# EAGLE design power (EAGLE 9.6.2)
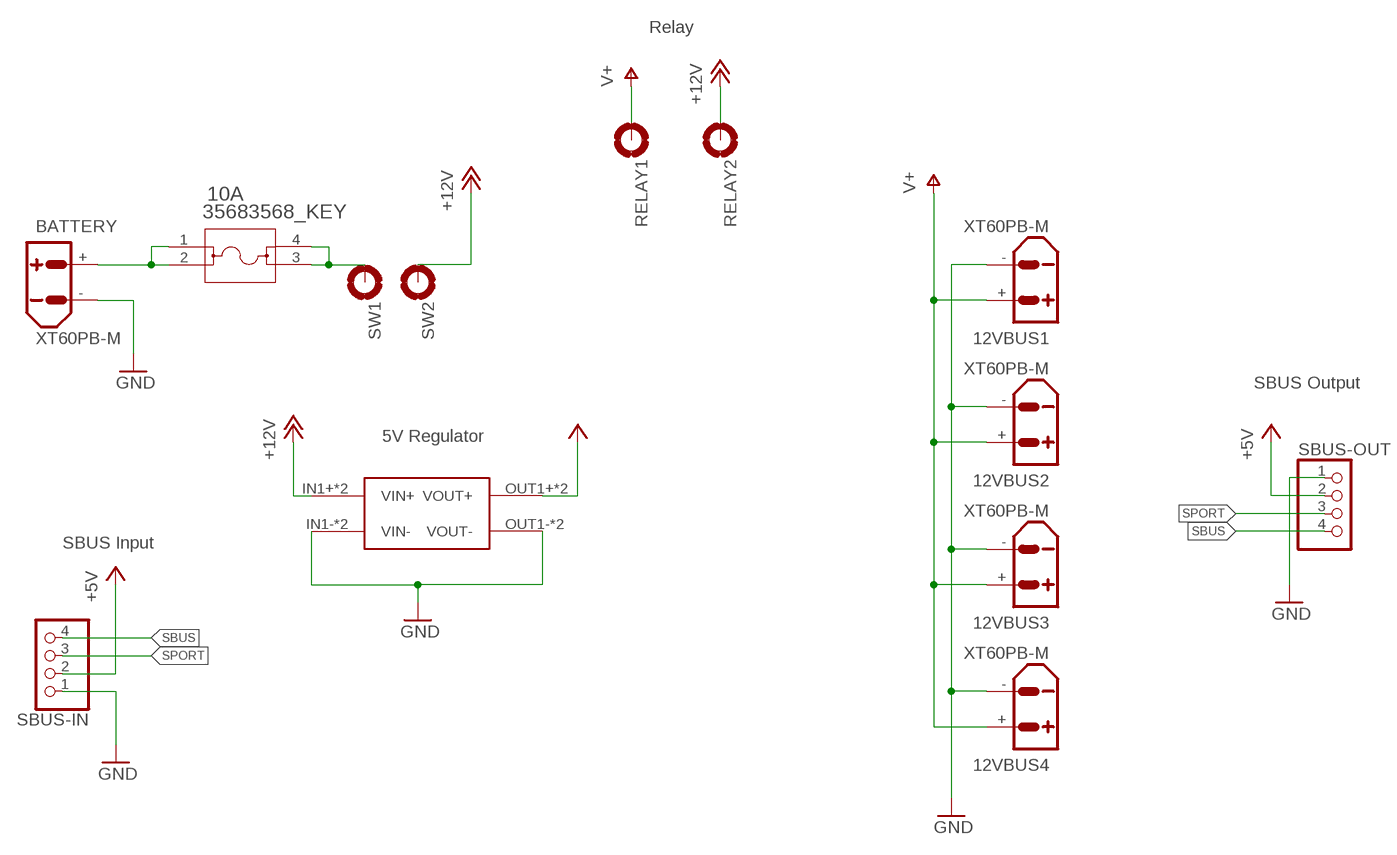
[diagram p0: schematic, sheet 1]

## Parts
10A  35683568_KEY  [3568_KEY]
12VBUS1  XT60PB-M  [XT60PB-M]
12VBUS2  XT60PB-M  [XT60PB-M]
12VBUS3  XT60PB-M  [XT60PB-M]
12VBUS4  XT60PB-M  [XT60PB-M]
BATTERY  XT60PB-M  [XT60PB-M]
RELAY1  MOUNT-PAD-ROUND2.8  [2,8-PAD]
RELAY2  MOUNT-PAD-ROUND2.8  [2,8-PAD]
SBUS-IN  PINHD-1X4  [1X04]
SBUS-OUT  PINHD-1X4  [1X04]
SW1  MOUNT-PAD-ROUND2.8  [2,8-PAD]
SW2  MOUNT-PAD-ROUND2.8  [2,8-PAD]
U$2  MP1584  [DC-BRICK]

## Nets
+5V: SBUS-IN.2 SBUS-OUT.2 U$2.OUT1+(VOUT+) U$2.OUT2+(VOUT+)
+12V: RELAY2.B2,8(MOUNT) SW2.B2,8(MOUNT) U$2.IN1+(VIN+) U$2.IN2+(VIN+)
GND: 12VBUS1.- 12VBUS2.- 12VBUS3.- 12VBUS4.- BATTERY.- SBUS-IN.1 SBUS-OUT.1 U$2.IN1-(VIN-) U$2.IN2-(VIN-) U$2.OUT1-(VOUT-) U$2.OUT2-(VOUT-)
N$1: 10A.1 10A.2 BATTERY.+
N$2: 10A.3 10A.4 SW1.B2,8(MOUNT)
SBUS: SBUS-IN.4 SBUS-OUT.4
SPORT: SBUS-IN.3 SBUS-OUT.3
V+: 12VBUS1.+ 12VBUS2.+ 12VBUS3.+ 12VBUS4.+ RELAY1.B2,8(MOUNT)

## Notes on the sheet
- Relay
- SBUS Output
- 5V Regulator
- SBUS Input

## Library data of the parts
10A = 2023-12-03_23-13-37_Library:3568; COPYRIGHT: Copyright (C) 2023 Ultra Librarian. All rights reserved.; MANUFACTURER_PART_NUMBER: 3568; MFR_NAME: Keystone Electronics
12VBUS1-12VBUS4 BATTERY = amass:XT60: AMASS XT60 connector Store in Japan AMASS XT60 connector <https://szc.jp/ams-xt60>
RELAY1 RELAY2 SW1 SW2 = holes:MOUNT-PAD-ROUND: MOUNTING PAD, round
SBUS-IN SBUS-OUT = pinhead:PINHD-1X4: PIN HEADER
U$2 = MP1584-dc-brick:MP1584: MP1584-dc-brick-pcb Step down Input: 4.5V - 28V Ouput 0.8V - 25V max. 3A Cheap on ebay

## Board
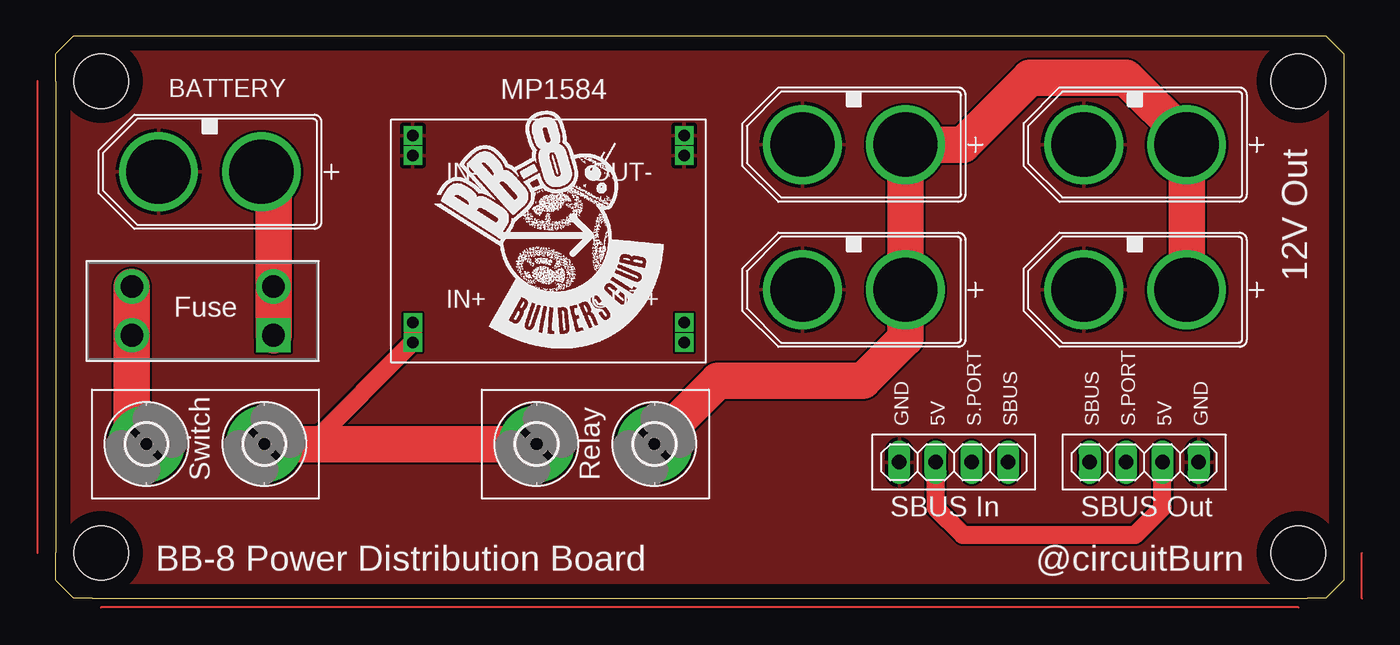
[diagram p1: board, top side]
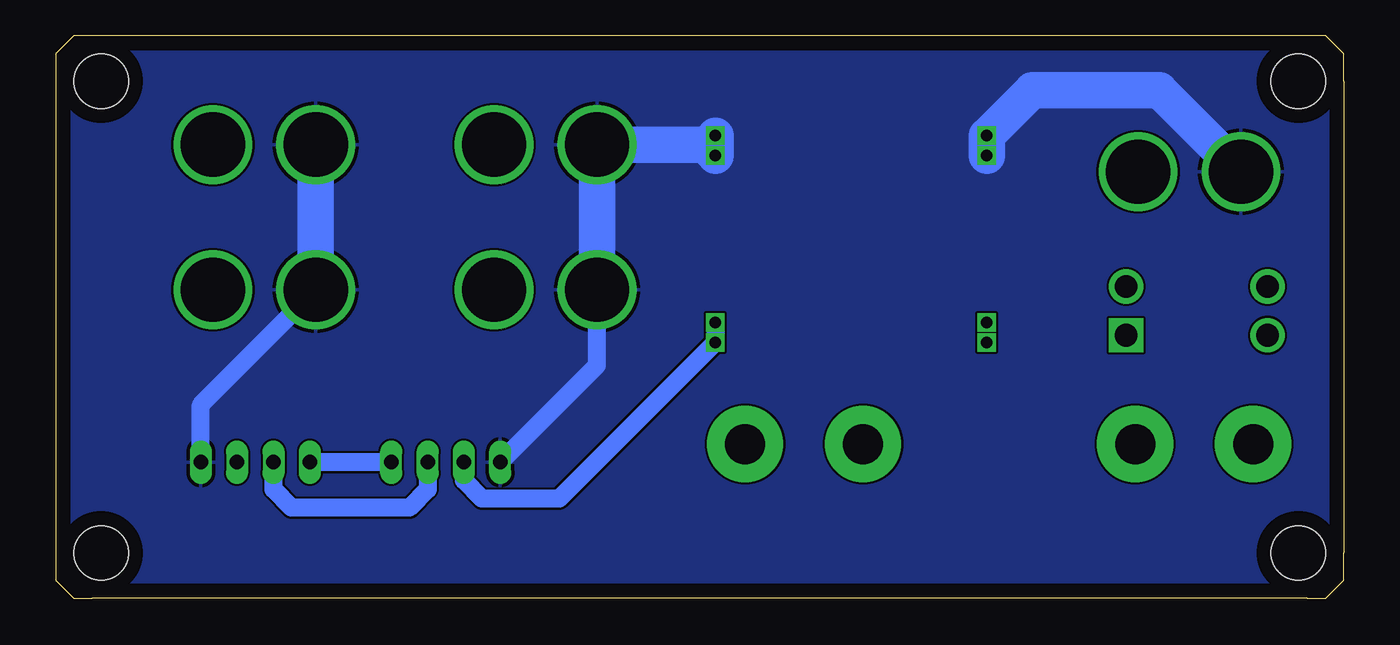
[diagram p2: board, bottom side, seen from below]

Size 90.17 x 39.37 mm. Coordinates in mm from the lower left corner, seen from the top.
Outline: 2.54,0 87.63,0 88.9,0 90.17,1.27 90.17,38.1 88.9,39.37 1.27,39.37 0,38.1 0,36.2 0,3.17 0,1.27 1.27,0 2.54,0
Copper layers (1*16): Top 0.035mm / dielectric 1.5mm / Bottom 0.035mm
Design rules "default": minimum track width 6mil, minimum drill 0.35mm, track to track 6mil, track to pad 6mil, pad to pad 6mil, via to via 6mil, smd to smd 6mil, copper to edge 40mil, drill to drill 6mil, minimum pad ring 10mil, minimum via ring 8mil, stop-mask expansion 4mil, vias tented up to drill 0mil, thermal gap 10mil
Holes 3.81 mm at 3.17,3.17 87,3.17 87,36.2 3.17,36.2

### Footprints (pad centres in the part's own frame; a part is rotated, then mirrored left to right if it is on the bottom)
3568_KEY = drill 1.6 pad 2.108 square: 1 0,0 | drill 1.6 pad 2.108: 2 0,-3.404; 3 9.906,-3.404; 4 9.906,0
XT60PB-M = drill 4.5: + 3.6,0; - -3.6,0
2,8-PAD = drill 2.8 pad 5.334: B2,8 0,0
1X04 = drill 1.016 long: 1 -3.81,0; 2 -1.27,0; 3 1.27,0; 4 3.81,0
DC-BRICK = drill 0.8 square: IN1+ 1.5,1.4; IN1- 1.5,14.47; IN2+ 1.5,2.8; IN2- 1.5,15.87; OUT1+ 20.5,1.4; OUT1- 20.5,14.47; OUT2+ 20.5,2.8; OUT2- 20.5,15.87

### Placement (x,y rotation side)
10A  15.24,18.42 180 top
12VBUS1  55.88,31.75 0 top
12VBUS2  55.88,21.59 0 top
12VBUS3  75.56,31.75 0 top
12VBUS4  75.56,21.59 0 top
BATTERY  10.79,29.85 0 top
RELAY1  41.91,10.79 0 top
RELAY2  33.66,10.79 0 top
SBUS-IN  62.87,9.53 0 top
SBUS-OUT  76.2,9.53 180 top
SW1  6.35,10.79 0 top
SW2  14.61,10.79 0 top
U$2  23.5,16.51 0 top

### Tracks (layer width: path | path; a pad name or v marks a point on that pad's centre or on a via)
+5V
  Top 1.27: SBUS-OUT.2 77.47,6.35 75.56,4.45 63.5,4.45 61.59,6.35 SBUS-IN.2
  Bottom 1.27: U$2.OUT2+ U$2.OUT1+ 54.92,6.98 60.33,6.98 61.59,8.26 SBUS-IN.2
+12V
  Top 1.27: U$2.IN2+ U$2.IN1+ 17.88,10.79
  Top 2.54: 32.11,10.79 RELAY2.B2,8 SW2.B2,8 17.88,10.79
GND
  Bottom 1.27: 12VBUS4.- 80.01,13.54 SBUS-OUT.1 | SBUS-IN.1 52.28,16.3 12VBUS2.-
  Bottom 2.54: BATTERY.- 12.91,35.56 21.82,35.56 U$2.IN2- U$2.IN1- | U$2.OUT2- U$2.OUT1- 44.77,31.75 12VBUS1.- 12VBUS2.- | 12VBUS3.- 12VBUS4.-
  pour Top: 0,1.27 0,38.1 1.27,39.37 88.9,39.37 90.17,38.1 90.17,1.27 88.9,0 1.27,0
  pour Bottom: 0,1.27 0,38.1 1.27,39.37 88.9,39.37 90.17,38.1 90.17,1.27 88.9,0 1.27,0
  pour Top: 0,1.27 0,38.1 1.27,39.37 88.9,39.37 90.17,38.1 90.17,1.27 88.9,0 1.27,0
  pour Bottom: 0,1.27 0,38.1 1.27,39.37 88.9,39.37 90.17,38.1 90.17,1.27 88.9,0 1.27,0
N$1
  Top 2.54: 10A.1 10A.2 15.24,29 BATTERY.+
N$2
  Top 2.54: SW1.B2,8 5.33,11.81 10A.4 10A.3
SBUS
  Bottom 1.27: SBUS-IN.4 SBUS-OUT.4
SPORT
  Bottom 1.27: SBUS-IN.3 64.14,7.62 65.41,6.35 73.66,6.35 74.93,7.62 SBUS-OUT.3
V+
  Top 2.54: 12VBUS4.+ 12VBUS3.+ 79.17,32.2 74.93,36.44 68.19,36.44 63.5,31.75 12VBUS1.+ 12VBUS2.+ 59.48,18.21 56.52,15.24 46.35,15.24 RELAY1.B2,8
(copper drawn outside any net)
  shapes: Top area x4

### Text on the board
tPlace: MP1584 | 12V Out | Fuse | GND | 5V | S.PORT | SBUS | SBUS | S.PORT | 5V | GND | Switch | Relay | SBUS In | SBUS Out | BB-8 Power Distribution Board | @circuitBurn